# EAGLE design neopixel-controller (EAGLE 9.6.2)
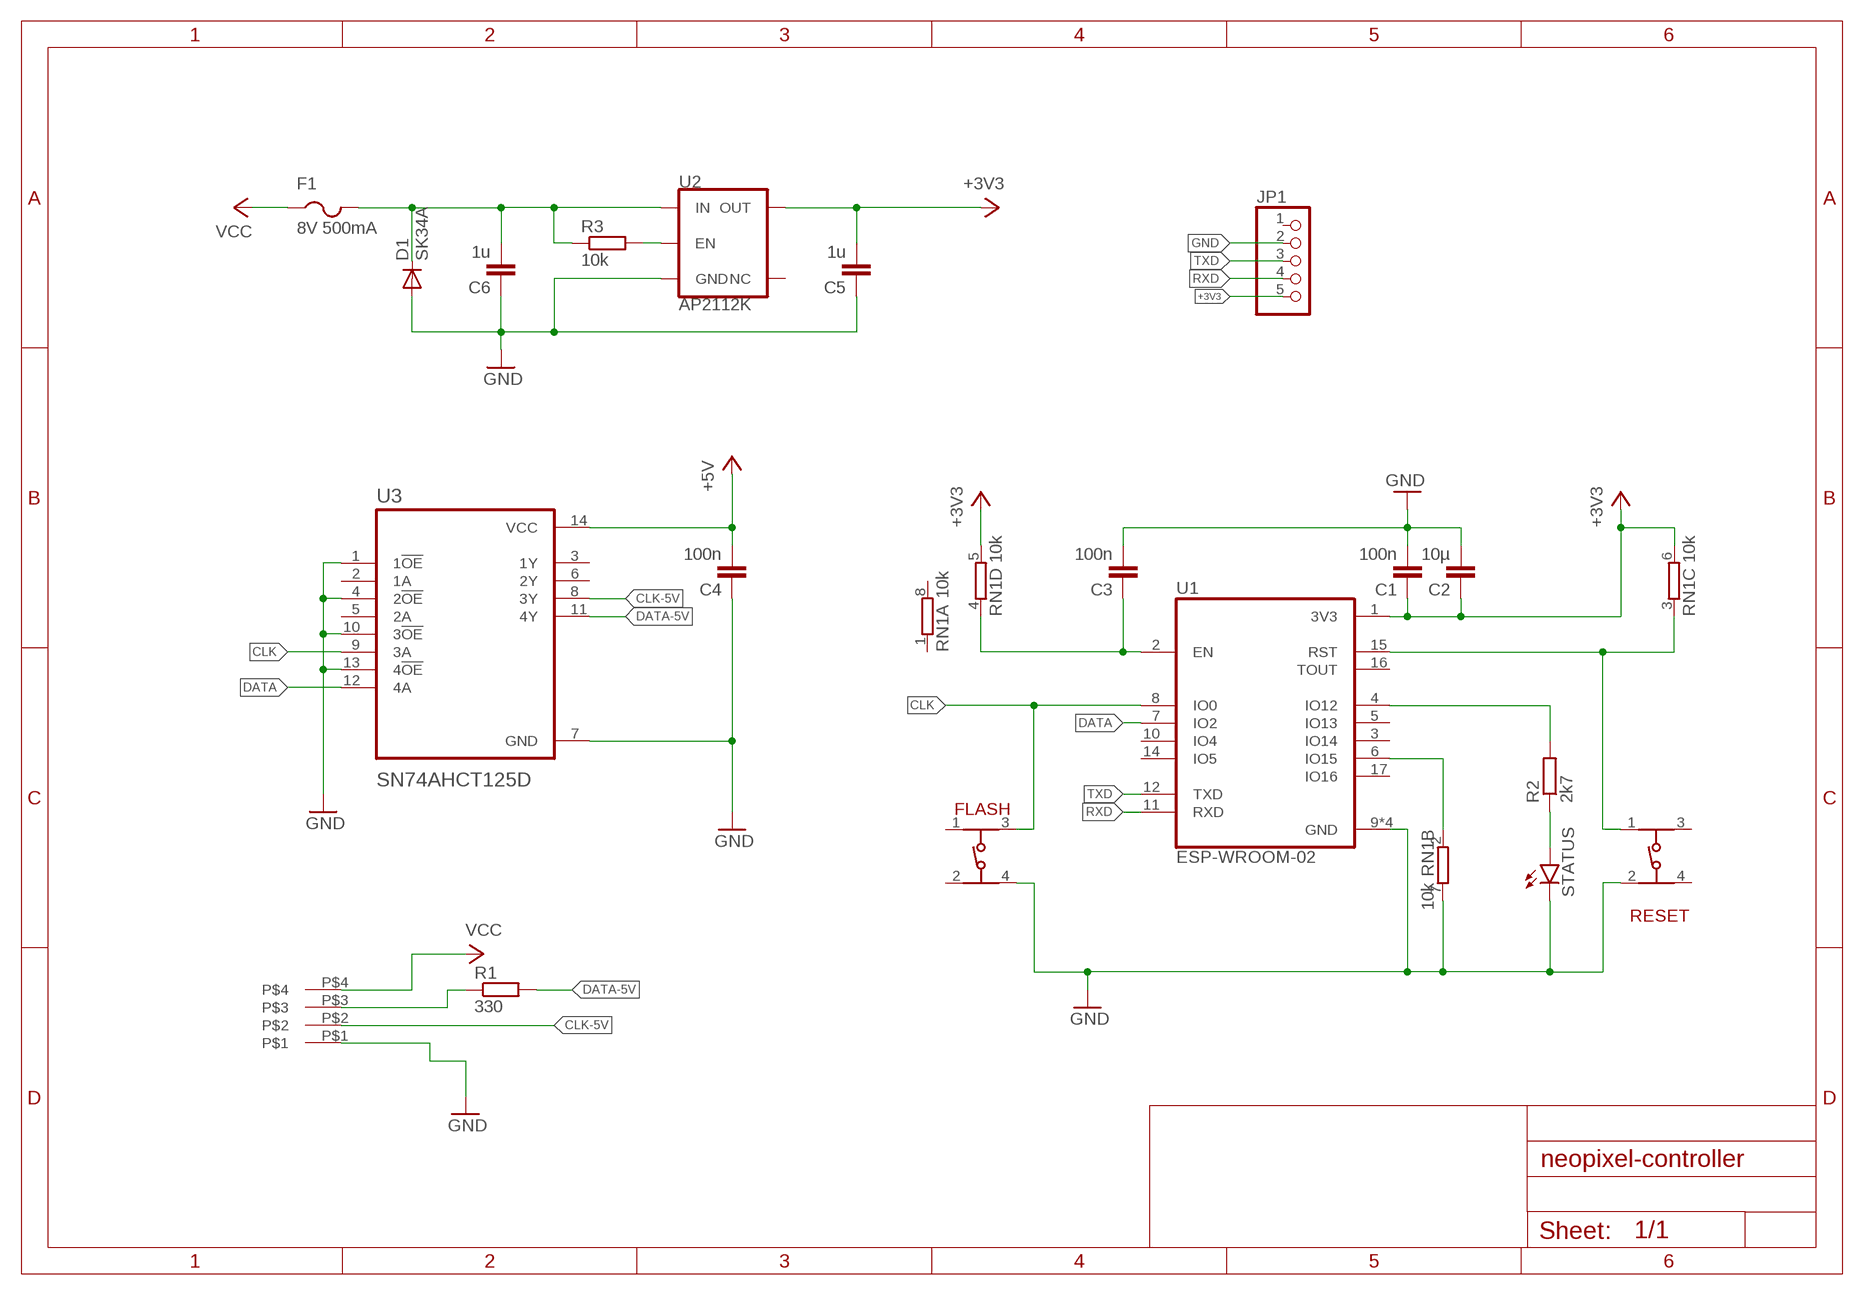
[diagram p0: schematic, sheet 1]

## Parts
C1  100n  C-EUC0805  [C0805]
C2  10µ  C-EUC0805  [C0805]
C3  100n  C-EUC0805  [C0805]
C4  100n  C-EUC0805  [C0805]
C5  1u  C-EUC0805  [C0805]
C6  1u  C-EUC0805  [C0805]
D1  SK34A  DIODE-DO214AC  [DO214AC]
F1  8V 500mA  PTCFUSE-1206  [R1206]
FLASH  434153017835  [434153017835]
JP1  PINHD-1X5  [1X05]
R1  330  R-EU_R0805  [R0805]
R2  2k7  R-EU_R0805  [R0805]
R3  10k  R-EU_R0805  [R0805]
RESET  434153017835  [434153017835]
RN1  10k  4R-NEXB38V  [EXB38V]
STATUS  LEDCHIPLED_0805  [CHIPLED_0805]
U1  ESP-WROOM-02  [MODULE_ESP-WROOM-02]
U2  AP2112K  V_REG_AP2112K-3.3V  [SOT23-5]
U3  SN74AHCT125D  [SOIC127P600X175-14N]
U$101  MCV-1,5/4-G-3,81  [MCV-1,5/4-G-3,81]

## Nets
+3V3: C1.1 C2.1 C5.2 JP1.5 RN1.5 RN1.6 U1.1(3V3) U2.5(OUT)
+5V: C4.2 C6.2 D1.C F1.2 R3.1 U2.1(IN) U3.14(VCC)
BOOTMODE: RN1.2 U1.6(IO15)
CHIPEN: C3.1 RN1.4 U1.2(EN)
CLK: FLASH.3 U1.8(IO0) U3.9(3A)
CLK-5V: U3.8(3Y) U$101.P$2
DATA: U1.7(IO2) U3.12(4A)
DATA-5V: R1.2 U3.11(4Y)
DATA-5VR: R1.1 U$101.P$3
GND: C1.2 C2.2 C3.2 C4.1 C5.1 C6.1 D1.A FLASH.4 JP1.2 RESET.2 RN1.7 STATUS.C U1.9(GND) U1.13(GND) U1.18(GND) U1.19(GND) U2.2(GND) U3.1(1!OE) U3.4(2!OE) U3.7(GND) U3.10(3!OE) U3.13(4!OE) U$101.P$1
N$1: R3.2 U2.3(EN)
N$2: R2.1 STATUS.A
RST: RESET.1 RN1.3 U1.15(RST)
RXD: JP1.4 U1.11(RXD)
STATLED: R2.2 U1.4(IO12)
TXD: JP1.3 U1.12(TXD)
VCC: F1.1 U$101.P$4
Unconnected: FLASH.1 FLASH.2 JP1.1 RESET.3 RESET.4 RN1.1 RN1.8 U1.3(IO14) U1.5(IO13) U1.10(IO4) U1.14(IO5) U1.16(TOUT) U1.17(IO16) U2.4(NC) U3.2(1A) U3.3(1Y) U3.5(2A) U3.6(2Y)

## Library data of the parts
C1-C6 = rcl:C-EU: CAPACITOR, European symbol; SPICEPREFIX: C
D1 = diode:DIODE-: DIODE
F1 = adafruit:PTCFUSE: PTC fuses, resettable thermistors
FLASH RESET = 434153017835_Eagle_WS-TASV_rev20a:434153017835: WS-TASV J-Bend SMT Tact Switch 3.5x2.9 mm Material Properties Cover Material : Stainless Steel Properties Actuator Material:LCP Actuator Flammability Rating:UL94 V-0 Actuator Color:Blue Frame Material:PA46 Frame Flammability Rating:UL94 HB Frame Color:Black Contact Material:Stainless Steel Contact Plating:Silver Terminal Material:Copper Alloy Terminal Plating:Silver VR:12 V (DC) Contact Resistance Initial:100 mΩ Contact Resistance After Life Test:1 Ω RISO:100 MΩ Withstanding Voltage:250 V (AC) Washable:No Qty.:4000 Mechanical Properties Stroke :0.15 mm General Information Operating Temperature:-40 up to +85 °C Washable:No Packaging Properties Packaging:Tape and Reel <https://www.we-online.com/catalog/media/o72753v209%20WS-TASU_434331013822_a_4C.jpg> Details see: https://www.we-online.com/catalog/en/TASV_3_5X2_9_SMD_J-BEND/ Updated by yingchun,Shan;2020-02-18 2020(C) Würth Elektronik; DATASHEET-URL: https://www.we-online.com/catalog/datasheet/434153017835.pdf; H: 1.7mm; OPERATION-FORCE: 350g; PART-NUMBER: 434153017835; QTY: 4000
JP1 = pinhead:PINHD-1X5: PIN HEADER
R1-R3 = rcl:R-EU_: RESISTOR, European symbol; SPICEPREFIX: R
RN1 = resistor-dil:4R-N: Array Chip Resistor Source: RS Component / Phycomp; OC_FARNELL: unknown; OC_NEWARK: unknown
STATUS = led:LED: LED OSRAM: - CHIPLED LG R971, LG N971, LY N971, LG Q971, LY Q971, LO R971, LY R971 LH N974, LH R974 LS Q976, LO Q976, LY Q976 LO Q996 - Hyper CHIPLED LW Q18S LB Q993, LB Q99A, LB R99A - SideLED LS A670, LO A670, LY A670, LG A670, LP A670 LB A673, LV A673, LT A673, LW A673 LH A674 LY A675 LS A676, LA A676, LO A676, LY A676, LW A676 LS A679, LY A679, LG A679 - Hyper Micro SIDELED® LS Y876, LA Y876, LO Y876, LY Y876 LT Y87S - SmartLED LW L88C, LW L88S LB L89C, LB L89S, LG L890 LS L89K, LO L89K, LY L89K LS L896, LA L896, LO L896, LY L896 - TOPLED LS T670, LO T670, LY T670, LG T670, LP T670 LSG T670, LSP T670, LSY T670, LOP T670, LYG T670 LG T671, LOG T671, LSG T671 LB T673, LV T673, LT T673, LW T673 LH T674 LS T676, LA T676, LO T676, LY T676, LB T676, LH T676, LSB T676, LW T676 LB T67C, LV T67C, LT T67C, LS T67K, LO T67K, LY T67K, LW E67C LS E67B, LA E67B, LO E67B, LY E67B, LB E67C, LV E67C, LT E67C LW T67C LS T679, LY T679, LG T679 LS T770, LO T770, LY T770, LG T770, LP T770 LB T773, LV T773, LT T773, LW T773 LH T774 LS E675, LA E675, LY E675, LS T675 LS T776, LA T776, LO T776, LY T776, LB T776 LHGB T686 LT T68C, LB T68C - Hyper Mini TOPLED® LB M676 - Mini TOPLED Santana® LG M470 LS M47K, LO M47K, LY M47K Source: http://www.osram.convergy.de LUXEON: - LUMILED® LXK2-PW12-R00, LXK2-PW12-S00, LXK2-PW14-U00, LXK2-PW14-V00 LXK2-PM12-R00, LXK2-PM12-S00, LXK2-PM14-U00 LXK2-PE12-Q00, LXK2-PE12-R00, LXK2-PE12-S00, LXK2-PE14-T00, LXK2-PE14-U00 LXK2-PB12-K00, LXK2-PB12-L00, LXK2-PB12-M00, LXK2-PB14-N00, LXK2-PB14-P00, LXK2-PB14-Q00 LXK2-PR12-L00, LXK2-PR12-M00, LXK2-PR14-Q00, LXK2-PR14-R00 LXK2-PD12-Q00, LXK2-PD12-R00, LXK2-PD12-S00 LXK2-PH12-R00, LXK2-PH12-S00 LXK2-PL12-P00, LXK2-PL12-Q00, LXK2-PL12-R00 Source: www.luxeon.com KINGBRIGHT: KA-3528ASYC Source: www.kingbright.com
U1 = ESP-WROOM-02:ESP-WROOM-02: Wi-Fi Module w/ESP8266 802.11b/g/n 20dBm 20x18x3mm; AVAILABILITY: Unavailable; DESCRIPTION: Wi-Fi Module w/ESP8266 802.11b/g/n 20dBm 20x18x3mm; MF: Espressif Systems; MP: ESP-WROOM-02; PACKAGE: SMD-18 Espressif Systems; PRICE: None
U2 = SparkFun-IC-Power:V_REG_AP2112: AP2112 - 600mA CMOS LDO Regulator w/ Enable The AP2112 is CMOS process low dropout linear regulator with enable function, the regulator delivers a guaranteed 600mA (min.) continuous load current. Features Output Voltage Accuracy: ±1.5% Output Current: 600mA (Min.) Foldback Short Current Protection: 50mA Enable Function to Turn ON/OFF VOUT Low Dropout Voltage (3.3V): 250mV (Typ.) @IOUT=600mA Excellent Load Regulation: 0.2%/A (Typ.) Excellent Line Regulation: 0.02%/V (Typ.) Low Quiescent Current: 55μA (Typ.) Low Standby Current: 0.01μA (Typ.) Low Output Noise: 50μVRMS PSRR: 100Hz -65dB, 1kHz -65dB OTSD Protection Stable with 1.0μF Flexible Cap: Ceramic, Tantalum and Aluminum Electrolytic Operation Temperature Range: -40°C to 85°C ESD: MM 400V, HBM 4000V; PROD_ID: VREG-12457; VALUE: 3.3V
U3 = SN74AHCT125D:SN74AHCT125D: Check prices <https://snapeda.com/parts/SN74AHCT125D/Texas%20Instruments/view-part/?ref=eda>; ARROW_ELECTRONICS-PURCHASE-URL: https://snapeda.com/shop?store=Arrow+Electronics&id=359107; AVAILABILITY: Good; DESCRIPTION: Quadruple Bus Buffer Gates With 3-State Outputs 14-SOIC -40 to 125; DIGIKEY-PURCHASE-URL: https://snapeda.com/shop?store=DigiKey&id=359107; MF: Texas Instruments; MOUSER-PURCHASE-URL: https://snapeda.com/shop?store=Mouser&id=359107; MP: SN74AHCT125D; PACKAGE: SOIC-14 Texas Instruments; PRICE: None; TEXAS_INSTRUMENTS-PURCHASE-URL: https://snapeda.com/shop?store=Texas+Instruments&id=359107
U$101 = codm:MCV-1,5/4-G-3,81

## Board
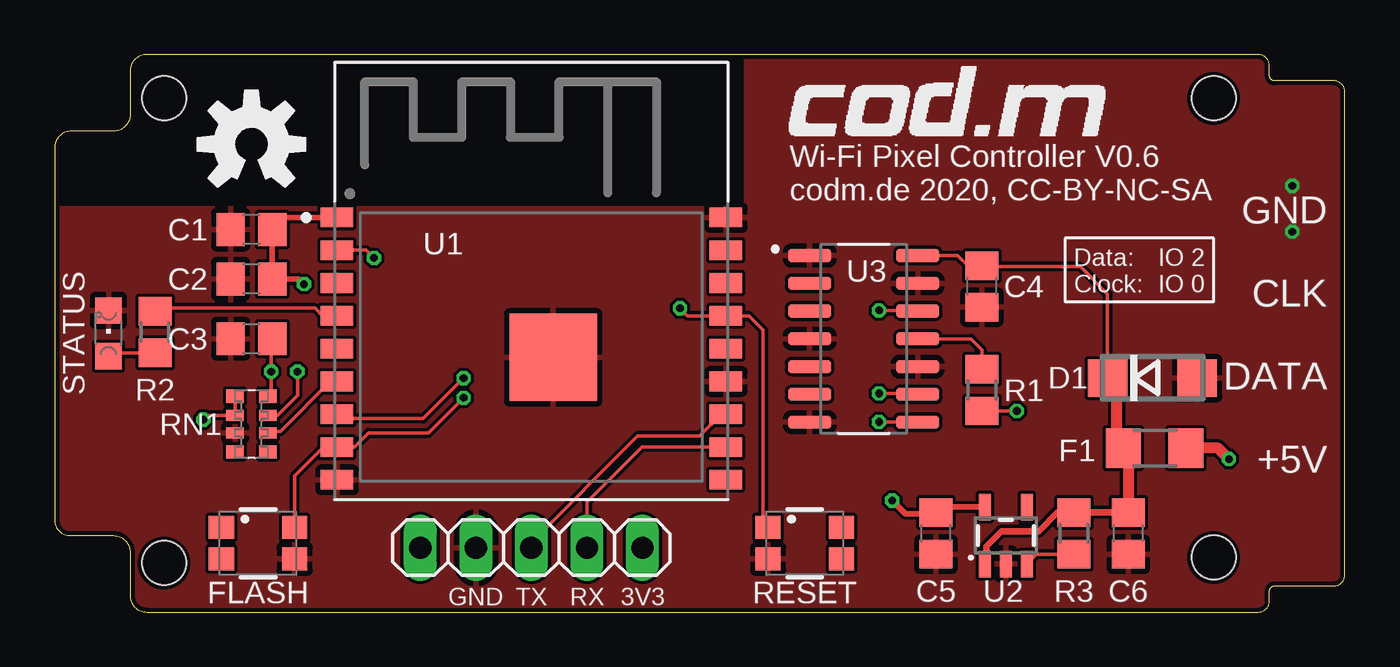
[diagram p1: board, top side]
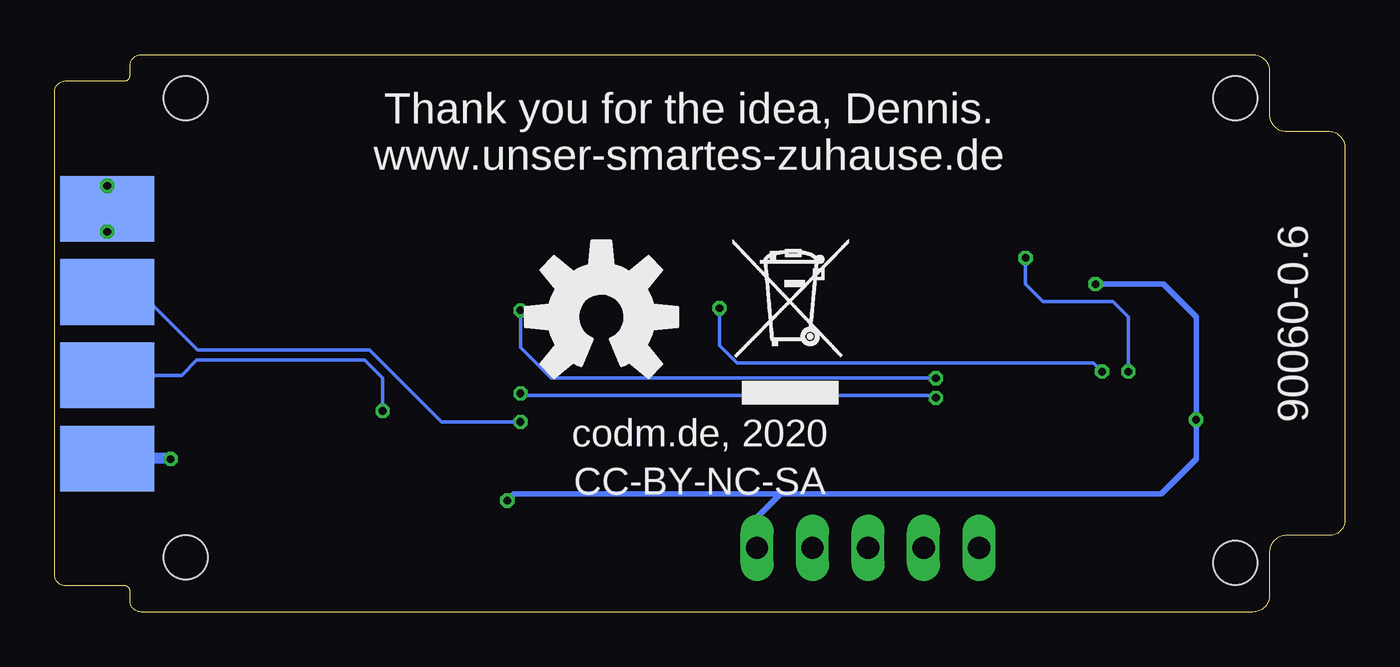
[diagram p2: board, bottom side, seen from below]

Size 59 x 25.5 mm. Coordinates in mm from the lower left corner, seen from the top.
Outline: 4.2,0 55.05,0 arc90 55.55,0.5 55.55,0.95 arc-90 55.8,1.2 58.5,1.2 arc90 59,1.7 59,23.8 arc90 58.5,24.3 55.8,24.3 arc-90 55.55,24.55 55.55,25 arc90 55.05,25.5 4.2,25.5 arc90 3.45,24.75 3.45,22.75 arc-90 2.7,22 0.75,22 arc90 0,21.25 0,4.2 arc90 0.7,3.5 2.7,3.5 arc-90 3.45,2.7 3.45,0.75 arc90 4.2,0
Copper layers (1*16): Top 0.035mm / dielectric 1.5mm / Bottom 0.035mm
Design rules "aisler_2_layer": minimum track width 0.1mm, minimum drill 0.2mm, track to track 0.1mm, track to pad 0.1mm, pad to pad 0.1mm, via to via 0.1mm, smd to smd 0.1mm, copper to edge 0.2mm, drill to drill 0.21mm, minimum pad ring 0.25mm, minimum via ring 0.15mm, stop-mask expansion 0mil, vias tented up to drill 0mil, thermal gap 10mil
Holes 2 mm at 5,2.25 5,23.5 53,23.5 53,2.5

### Footprints (pad centres in the part's own frame; a part is rotated, then mirrored left to right if it is on the bottom)
C0805 = smd 1.3 x 1.5: 1 -0.95,0; 2 0.95,0
DO214AC = smd 1.8 x 1.7: A 2.05,0; C -2.05,0
R1206 = smd 1.6 x 1.803: 1 -1.422,0; 2 1.422,0
434153017835 = smd 1.15 x 1.05: 1 -1.675,0.725; 2 -1.675,-0.725; 3 1.675,0.725; 4 1.675,-0.725
1X05 = drill 1.016 long: 1 -5.08,0; 2 -2.54,0; 3 0,0; 4 2.54,0; 5 5.08,0
R0805 = smd 1.3 x 1.5: 1 -0.95,0; 2 0.95,0
EXB38V = smd 0.6 x 0.8: 1 -1.275,-0.75; 4 1.275,-0.75; 5 1.275,0.75; 8 -1.275,0.75 | smd 0.5 x 0.8: 2 -0.4,-0.75; 3 0.4,-0.75; 6 0.4,0.75; 7 -0.4,0.75
CHIPLED_0805 = smd 1.2 x 1.2: A 0,-1.05; C 0,1.05
MODULE_ESP-WROOM-02 = smd 1.485 x 0.9: 1 -8.893,4.9; 2 -8.893,3.4; 3 -8.893,1.9; 4 -8.893,0.4; 5 -8.893,-1.1; 6 -8.893,-2.6; 7 -8.893,-4.1; 8 -8.893,-5.6; 9 -8.893,-7.1; 10 8.893,-7.1; 11 8.893,-5.6; 12 8.893,-4.1; 13 8.893,-2.6; 14 8.893,-1.1; 15 8.893,0.4; 16 8.893,1.9; 17 8.893,3.4; 18 8.893,4.9 | smd 4 x 4: 19 1,-1.5
SOT23-5 = smd 0.55 x 1.2: 1 -0.95,-1.3; 2 0,-1.3; 3 0.95,-1.3; 4 0.95,1.3; 5 -0.95,1.3
SOIC127P600X175-14N = smd 1.97 x 0.6: 1 -2.475,3.81; 2 -2.475,2.54; 3 -2.475,1.27; 4 -2.475,0; 5 -2.475,-1.27; 6 -2.475,-2.54; 7 -2.475,-3.81; 8 2.475,-3.81; 9 2.475,-2.54; 10 2.475,-1.27; 11 2.475,0; 12 2.475,1.27; 13 2.475,2.54; 14 2.475,3.81
MCV-1,5/4-G-3,81 = smd 4.3 x 3: P$1 0,-5.7; P$2 0,-1.89; P$3 0,1.92; P$4 0,5.73

### Placement (x,y rotation side)
C1  9,17.5 180 top
C2  9,15.24 180 top
C3  9,12.5 180 top
C4  42.4,14.9 90 top
C5  40.3,3.6 90 top
C6  49.1,3.6 90 top
D1  50.2,10.7 0 top
F1  50.3,7.5 180 top
FLASH  9.3,3.15 0 top
JP1  21.8,2.94 0 top
R1  42.4,10.15 90 top
R2  4.59,12.81 90 top
R3  46.61,3.6 270 top
RESET  34.3,3.15 0 top
RN1  9,8.6 90 top
STATUS  2.46,12.75 0 top
U1  21.8,13.15 0 top
U2  43.5,3.5 0 top
U3  37,12.5 0 top
U$1  [CODM-LOGO]  33.6,21.8 0 top
U$2  [OSHW-LOGO-M]  9,21.4 0 top
U$100  [WEEE-LOGO-5MM]  28,9.5 0 bottom
U$101  56.6,12.75 180 bottom
U$102  [OSHW-LOGO-L]  34,13.5 0 bottom

### Tracks (layer width: path | path; a pad name or v marks a point on that pad's centre or on a via)
+3V3  (via drill 0.35)
  Top 0.152: v6.8,8.8 7,9 RN1.6 RN1.5
  Top 0.254: U1.1 10.5,18.05 C1.1 C2.1 11.16,15.24 v11.4,15 | U2.5 40.55,4.8 C5.2 40.25,4.5 38.9,4.5 v38.3,5.1
  Bottom 0.254: v11.4,15 8.3,15 6.8,13.5 v6.8,8.8 6.8,7 8.4,5.4 25.82,5.4 | JP1.5 26.88,4.34 25.82,5.4 | 25.82,5.4 38,5.4 v38.3,5.1
+5V
  Top 0.152: D1.C 48.15,14.55 46.9,15.8 42.35,15.8 | 42.35,15.8 C4.2 | U3.14 41.29,16.31 41.8,15.8 42.35,15.8
  Top 0.305: C6.2 R3.1 45.85,4.55 45,3.7 43.3,3.7 42.6,3 42.6,2.25 U2.1
  Top 0.508: C6.2 49.1,7.28 F1.2 48.58,7.8 48.58,10.27 D1.C
BOOTMODE
  Top 0.152: RN1.2 9.82,8.27 10.32,8.27 12.6,10.55 U1.6
CHIPEN  (via drill 0.35)
  Top 0.152: U1.2 14.25,16.55 v14.6,16.2 | C3.1 9.9,12.45 v9.9,11 9.9,10.03 RN1.4
  Bottom 0.152: v9.9,11 9.9,13.5 10.6,14.2 13.8,14.2 14.6,15 v14.6,16.2
CLK  (via drill 0.35)
  Top 0.152: v18.7,9.8 17.1,8.2 14.36,8.2 13.71,7.55 U1.8 12.3,7.55 10.97,6.22 FLASH.3 | v37.7,10 39.44,10 U3.9
  Bottom 0.152: v37.7,10 37.6,9.9 18.8,9.9 v18.7,9.8
CLK-5V  (via drill 0.35)
  Top 0.152: v37.7,8.7 39.47,8.7 U3.8
  Bottom 0.152: U$101.P$2 55.1,14.64 52.46,12 44.6,12 41.3,8.7 v37.7,8.7
DATA  (via drill 0.35)
  Top 0.152: U1.7 13.11,8.85 16.85,8.85 v18.7,10.7 | v37.7,13.8 39.45,13.8 U3.12
  Bottom 0.152: v18.7,10.7 36.3,10.7 37.7,12.1 v37.7,13.8
DATA-5V
  Top 0.152: U3.11 41.9,12.5 42.4,12 R1.2
DATA-5VR  (via drill 0.35)
  Top 0.152: v44,9.2 R1.1
  Bottom 0.152: U$101.P$3 53.2,10.83 52.5,11.53 44.83,11.53 44,10.7 v44,9.2
GND  (via drill 0.35)
  Bottom 0.508: v56.6,17.4 U$101.P$1 v56.6,19.5
  pour Top (isolate 0.15): 0,0 0,18.5 31.6,18.5 31.6,26 59,26 59,0
N$1
  Top 0.152: R3.2 44.9,2.65 U2.3
N$2
  Top 0.152: STATUS.A 2.62,11.86 R2.1
RST  (via drill 0.35)
  Top 0.152: v11.1,11 11.1,9.9 10.2,9 RN1.3 | RESET.1 32.4,4.08 32.4,12.9 31.75,13.55 U1.15 28.95,13.55 v28.6,13.9
  Bottom 0.152: v28.6,13.9 28.6,12.2 27.8,11.4 11.5,11.4 v11.1,11
RXD
  Top 0.152: U1.11 26.85,7.55 24.34,5.04 JP1.4
STATLED
  Top 0.152: U1.4 12.25,13.55 11.9,13.9 4.73,13.9 R2.2
TXD
  Top 0.152: U1.12 30.49,9.05 29.49,8.05 26.65,8.05 21.8,3.2 JP1.3
VCC  (via drill 0.35)
  Top 0.508: F1.1 53.2,7.5 v53.7,7
  Bottom 0.305: v53.7,7 53.72,7.02
  Bottom 0.508: 53.72,7.02 U$101.P$4

### Text on the board
tNames: Wi-Fi Pixel Controller V0.6 / codm.de 2020, CC-BY-NC-SA | GND | Data: / Clock: | IO 2 / IO 0 | CLK | DATA | +5V | GND | TX | RX | 3V3
bNames: Thank you for the idea, Dennis. / www.unser-smartes-zuhause.de | 90060-0.6 | codm.de, 2020 | CC-BY-NC-SA